# Altium schematic sheet letter_Agrum.schdoc: Title goes here
size Letter; Author: Nicolás Velásquez; Organization: Agrum; Address1: Colombia
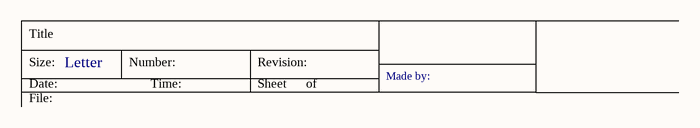
[diagram p0: letter_Agrum.schdoc]

## Notes on the sheet
- Title
- Size:
- Date:
- Letter
- Number:
- Time:
- Revision:
- Sheet
- of
- Made by:
- File: